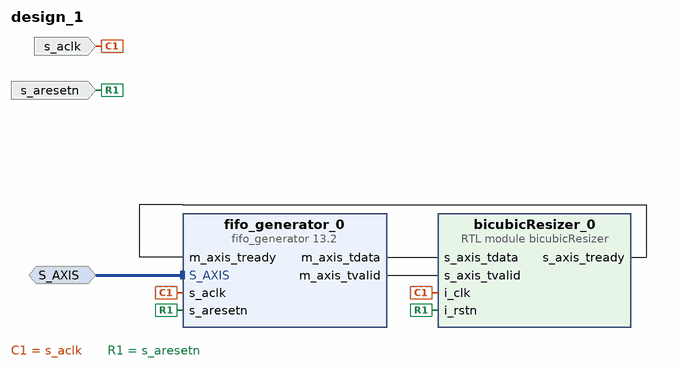
[diagram p0: block diagram of the top level]
# Vivado block design design_1, xczu9eg-ffvb1156-2-e, Vivado 2022.2
create_bd_design design_1

create_bd_intf_port -mode Slave -vlnv xilinx.com:interface:axis_rtl:1.0 S_AXIS
set_property -dict [list \
  CONFIG.HAS_TKEEP 0 \
  CONFIG.HAS_TLAST 0 \
  CONFIG.HAS_TREADY 1 \
  CONFIG.HAS_TSTRB 0 \
  CONFIG.LAYERED_METADATA undef \
  CONFIG.TDATA_NUM_BYTES 4 \
  CONFIG.TDEST_WIDTH 0 \
  CONFIG.TID_WIDTH 0 \
  CONFIG.TUSER_WIDTH 4 \
] [get_bd_intf_ports S_AXIS]
create_bd_port -dir I -type clk s_aclk
set_property -dict {CONFIG.FREQ_HZ 100000000} [get_bd_ports s_aclk]
create_bd_port -dir I -type rst s_aresetn

create_bd_cell -type ip -vlnv xilinx.com:ip:fifo_generator:13.2 fifo_generator_0
set_property -dict [list \
  CONFIG.FIFO_Implementation_axis Common_Clock_Block_RAM \
  CONFIG.INTERFACE_TYPE AXI_STREAM \
  CONFIG.Input_Depth_axis 2048 \
  CONFIG.TDATA_NUM_BYTES 4 \
] [get_bd_cells fifo_generator_0]
create_bd_cell -type module -reference bicubicResizer bicubicResizer_0

# ---- connections ----

connect_bd_intf_net [get_bd_intf_ports S_AXIS] [get_bd_intf_pins fifo_generator_0/S_AXIS]
connect_bd_net [get_bd_pins bicubicResizer_0/s_axis_tready] [get_bd_pins fifo_generator_0/m_axis_tready]
connect_bd_net [get_bd_pins fifo_generator_0/m_axis_tdata] [get_bd_pins bicubicResizer_0/s_axis_tdata]
connect_bd_net [get_bd_pins fifo_generator_0/m_axis_tvalid] [get_bd_pins bicubicResizer_0/s_axis_tvalid]
connect_bd_net [get_bd_ports s_aclk] [get_bd_pins fifo_generator_0/s_aclk] [get_bd_pins bicubicResizer_0/i_clk]
connect_bd_net [get_bd_ports s_aresetn] [get_bd_pins fifo_generator_0/s_aresetn] [get_bd_pins bicubicResizer_0/i_rstn]

validate_bd_design
save_bd_design
